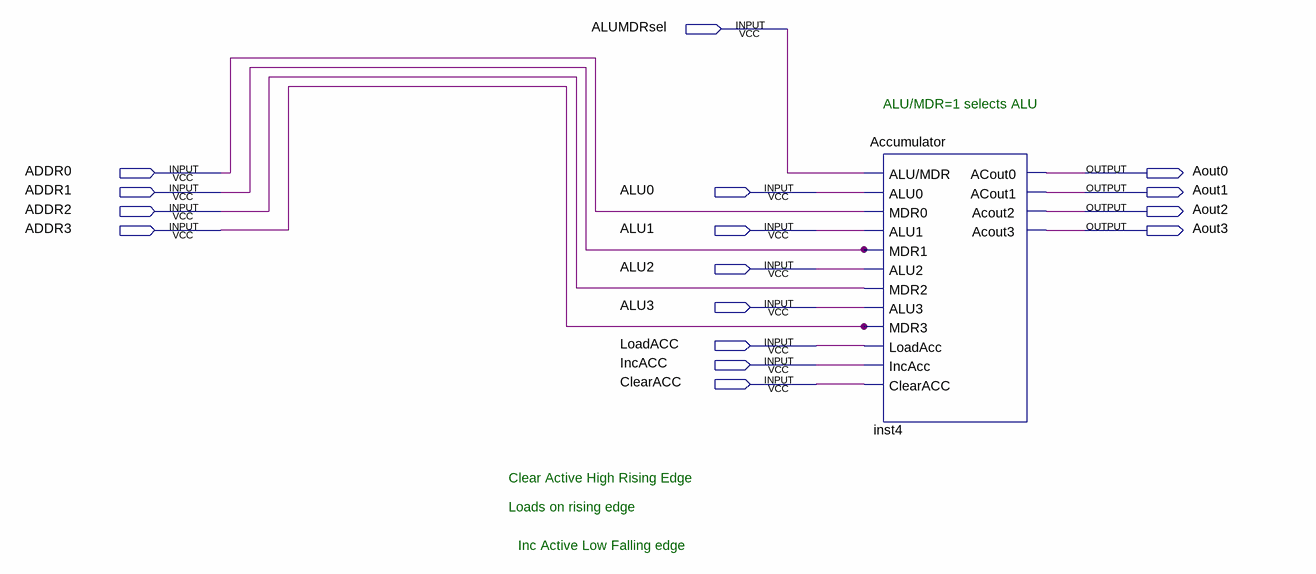
[diagram p0: schematic sheet]
// Quartus schematic accTest.bdf as structural Verilog: 1 symbols, 16 pins
module accTest (
  input  ALUMDRsel,
  input  ADDR0,
  input  ADDR1,
  input  ALU0,
  input  ADDR2,
  input  ADDR3,
  input  ALU1,
  input  ALU2,
  input  ALU3,
  input  LoadACC,
  input  IncACC,
  input  ClearACC,
  output Aout0,
  output Aout1,
  output Aout2,
  output Aout3
);

  Accumulator inst4 (
    .\ALU/MDR (ALUMDRsel), .ALU0(ALU0), .MDR0(ADDR0), .ALU1(ALU1), .MDR1(ADDR1), .ALU2(ALU2), .MDR2(ADDR2),
    .ALU3(ALU3), .MDR3(ADDR3), .LoadAcc(LoadACC), .IncAcc(IncACC), .ClearACC(ClearACC), .ACout0(Aout0),
    .ACout1(Aout1), .Acout2(Aout2), .Acout3(Aout3));

  // Notes on the sheet:
  //   ALU/MDR=1 selects ALU
  //   Clear Active High Rising Edge
  //   Loads on rising edge
  //   Inc Active Low Falling edge
endmodule
